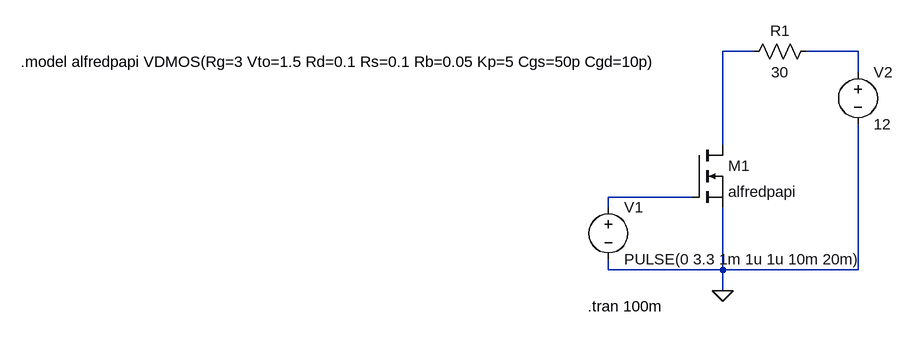
[diagram p0: schematic control_MOSFETs.asc]
control_MOSFETs.asc, the LTspice schematic file:
Version 4.1
SHEET 1 880 680
WIRE 240 -144 192 -144
WIRE 400 -144 320 -144
WIRE 400 -112 400 -144
WIRE 192 0 192 -144
WIRE 144 80 16 80
WIRE 16 96 16 80
WIRE 16 192 16 176
WIRE 192 192 192 96
WIRE 192 192 16 192
WIRE 400 192 400 -32
WIRE 400 192 192 192
WIRE 192 224 192 192
FLAG 192 224 0
SYMBOL nmos 144 0 R0
SYMATTR InstName M1
SYMATTR Value alfredpapi
SYMBOL voltage 16 80 R0
WINDOW 123 0 0 Left 0
WINDOW 39 0 0 Left 0
SYMATTR InstName V1
SYMATTR Value PULSE(0 3.3 1m 1u 1u 10m 20m)
SYMBOL voltage 400 -128 R0
SYMATTR InstName V2
SYMATTR Value 12
SYMBOL res 336 -160 R90
WINDOW 0 0 56 VBottom 2
WINDOW 3 32 56 VTop 2
SYMATTR InstName R1
SYMATTR Value 30
TEXT -16 248 Left 2 !.tran 100m
TEXT -888 -128 Left 2 !.model alfredpapi VDMOS(Rg=3 Vto=1.5 Rd=0.1 Rs=0.1 Rb=0.05 Kp=5 Cgs=50p Cgd=10p)

The netlist it stands for:
* control_MOSFETs.asc
M1 N001 N003 0 0 alfredpapi
V1 N003 0 PULSE(0 3.3 1m 1u 1u 10m 20m)
V2 N002 0 12
R1 N002 N001 30
.model NMOS NMOS
.model PMOS PMOS
.lib standard.mos
.tran 100m
.model alfredpapi VDMOS(Rg=3 Vto=1.5 Rd=0.1 Rs=0.1 Rb=0.05 Kp=5 Cgs=50p Cgd=10p)
.backanno
.end